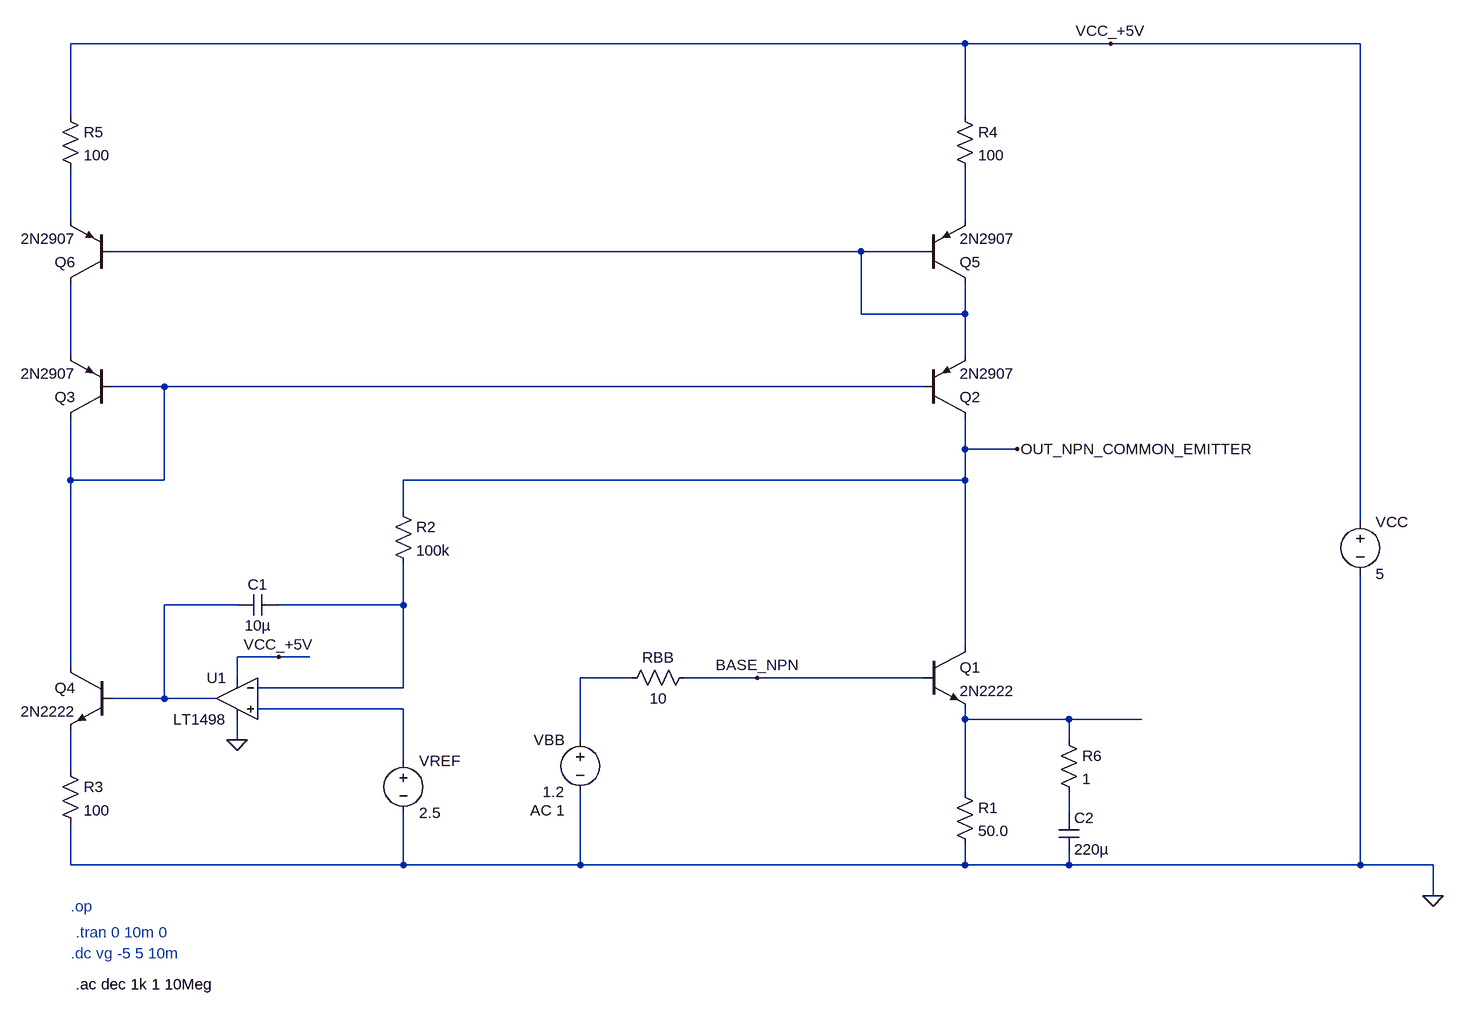
[diagram p0: schematic Common_Emitter_with_Adjustable_Bias_Current.asc]
Common_Emitter_with_Adjustable_Bias_Current.asc, the LTspice schematic file:
Version 4.1
SHEET 1 2452 1136
WIRE 272 -1088 -1104 -1088
WIRE 496 -1088 272 -1088
WIRE 880 -1088 496 -1088
WIRE -1104 -976 -1104 -1088
WIRE 272 -976 272 -1088
WIRE -1104 -816 -1104 -896
WIRE 272 -816 272 -896
WIRE 112 -768 -1040 -768
WIRE 208 -768 112 -768
WIRE 112 -672 112 -768
WIRE 272 -672 272 -720
WIRE 272 -672 112 -672
WIRE -1104 -608 -1104 -720
WIRE 272 -608 272 -672
WIRE -960 -560 -1040 -560
WIRE 208 -560 -960 -560
WIRE 272 -464 272 -512
WIRE 352 -464 272 -464
WIRE -1104 -416 -1104 -512
WIRE -960 -416 -960 -560
WIRE -960 -416 -1104 -416
WIRE 272 -416 272 -464
WIRE 272 -416 -592 -416
WIRE -592 -368 -592 -416
WIRE 880 -352 880 -1088
WIRE -848 -224 -960 -224
WIRE -592 -224 -592 -288
WIRE -592 -224 -784 -224
WIRE 272 -160 272 -416
WIRE -784 -144 -848 -144
WIRE -736 -144 -784 -144
WIRE -1104 -128 -1104 -416
WIRE -848 -112 -848 -144
WIRE -240 -112 -320 -112
WIRE -48 -112 -160 -112
WIRE 208 -112 -48 -112
WIRE -592 -96 -592 -224
WIRE -592 -96 -816 -96
WIRE -960 -80 -960 -224
WIRE -960 -80 -1040 -80
WIRE -880 -80 -960 -80
WIRE -592 -64 -816 -64
WIRE 272 -48 272 -64
WIRE 432 -48 272 -48
WIRE 544 -48 432 -48
WIRE -848 -16 -848 -48
WIRE -320 -16 -320 -112
WIRE 432 -16 432 -48
WIRE -592 16 -592 -64
WIRE -1104 32 -1104 -32
WIRE 272 64 272 -48
WIRE 432 96 432 64
WIRE -1104 176 -1104 112
WIRE -592 176 -592 96
WIRE -592 176 -1104 176
WIRE -320 176 -320 64
WIRE -320 176 -592 176
WIRE 272 176 272 144
WIRE 272 176 -320 176
WIRE 432 176 432 160
WIRE 432 176 272 176
WIRE 880 176 880 -272
WIRE 880 176 432 176
WIRE 992 176 880 176
WIRE 992 224 992 176
FLAG 992 224 0
FLAG 496 -1088 VCC_+5V
FLAG -48 -112 BASE_NPN
FLAG 352 -464 OUT_NPN_COMMON_EMITTER
FLAG -784 -144 VCC_+5V
FLAG -848 -16 0
DATAFLAG 272 -304 ""
DATAFLAG -240 -560 ""
DATAFLAG 128 -112 ""
DATAFLAG 464 -48 ""
DATAFLAG -240 -768 ""
SYMBOL voltage 880 -368 R0
WINDOW 123 0 0 Left 0
WINDOW 39 0 0 Left 0
SYMATTR InstName VCC
SYMATTR Value 5
SYMBOL npn 208 -160 R0
SYMATTR InstName Q1
SYMATTR Value 2N2222
SYMBOL pnp 208 -512 M180
SYMATTR InstName Q2
SYMATTR Value 2N2907
SYMBOL pnp -1040 -512 R180
SYMATTR InstName Q3
SYMATTR Value 2N2907
SYMBOL res -256 -96 R270
WINDOW 0 32 56 VTop 2
WINDOW 3 0 56 VBottom 2
SYMATTR InstName RBB
SYMATTR Value 10
SYMBOL res 256 48 R0
SYMATTR InstName R1
SYMATTR Value 50.0
SYMBOL OpAmps\\LT1498 -848 -144 M0
SYMATTR InstName U1
SYMBOL npn -1040 -128 M0
SYMATTR InstName Q4
SYMATTR Value 2N2222
SYMBOL voltage -320 -32 M0
WINDOW 123 24 124 Left 2
WINDOW 39 0 0 Left 0
SYMATTR InstName VBB
SYMATTR Value 1.2
SYMATTR Value2 AC 1
SYMBOL voltage -592 0 R0
WINDOW 123 0 0 Left 0
WINDOW 39 0 0 Left 0
SYMATTR InstName VREF
SYMATTR Value 2.5
SYMBOL res -608 -384 R0
SYMATTR InstName R2
SYMATTR Value 100k
SYMBOL cap -848 -208 R270
WINDOW 0 32 32 VTop 2
WINDOW 3 0 32 VBottom 2
SYMATTR InstName C1
SYMATTR Value 10µ
SYMBOL res -1120 16 R0
SYMATTR InstName R3
SYMATTR Value 100
SYMBOL res 256 -992 R0
SYMATTR InstName R4
SYMATTR Value 100
SYMBOL res -1120 -992 R0
SYMATTR InstName R5
SYMATTR Value 100
SYMBOL cap 416 96 R0
SYMATTR InstName C2
SYMATTR Value 220µ
SYMBOL pnp 208 -720 M180
SYMATTR InstName Q5
SYMATTR Value 2N2907
SYMBOL pnp -1040 -720 R180
SYMATTR InstName Q6
SYMATTR Value 2N2907
SYMBOL res 416 -32 R0
SYMATTR InstName R6
SYMATTR Value 1
TEXT -1096 280 Left 2 ;.tran 0 10m 0
TEXT -1104 312 Left 2 ;.dc vg -5 5 10m
TEXT -1104 240 Left 2 ;.op
TEXT -1096 360 Left 2 !.ac dec 1k 1 10Meg

The netlist it stands for:
* Common_Emitter_with_Adjustable_Bias_Current.asc
VCC VCC_+5V 0 5
Q1 OUT_NPN_COMMON_EMITTER BASE_NPN N010 0 2N2222
Q2 OUT_NPN_COMMON_EMITTER N005 N003 0 2N2907
Q3 N005 N005 N004 0 2N2907
RBB N008 BASE_NPN 10
R1 N010 0 50.0
X§U1 N009 N007 VCC_+5V 0 N006 LT1498  ; pins In+ In- V+ V- OUT
Q4 N005 N006 N011 0 2N2222
VBB N008 0 1.2 AC 1
VREF N009 0 2.5
R2 OUT_NPN_COMMON_EMITTER N007 100k
C1 N006 N007 10µ
R3 N011 0 100
R4 VCC_+5V N002 100
R5 VCC_+5V N001 100
C2 N012 0 220µ
Q5 N003 N003 N002 0 2N2907
Q6 N004 N003 N001 0 2N2907
R6 N010 N012 1
.model NPN NPN
.model PNP PNP
.lib standard.bjt
* .tran 0 10m 0
* .dc vg -5 5 10m
* .op
.ac dec 1k 1 10Meg
.lib LTC.lib
.backanno
.end